# Altium project wisp-5-0.PrjPcb
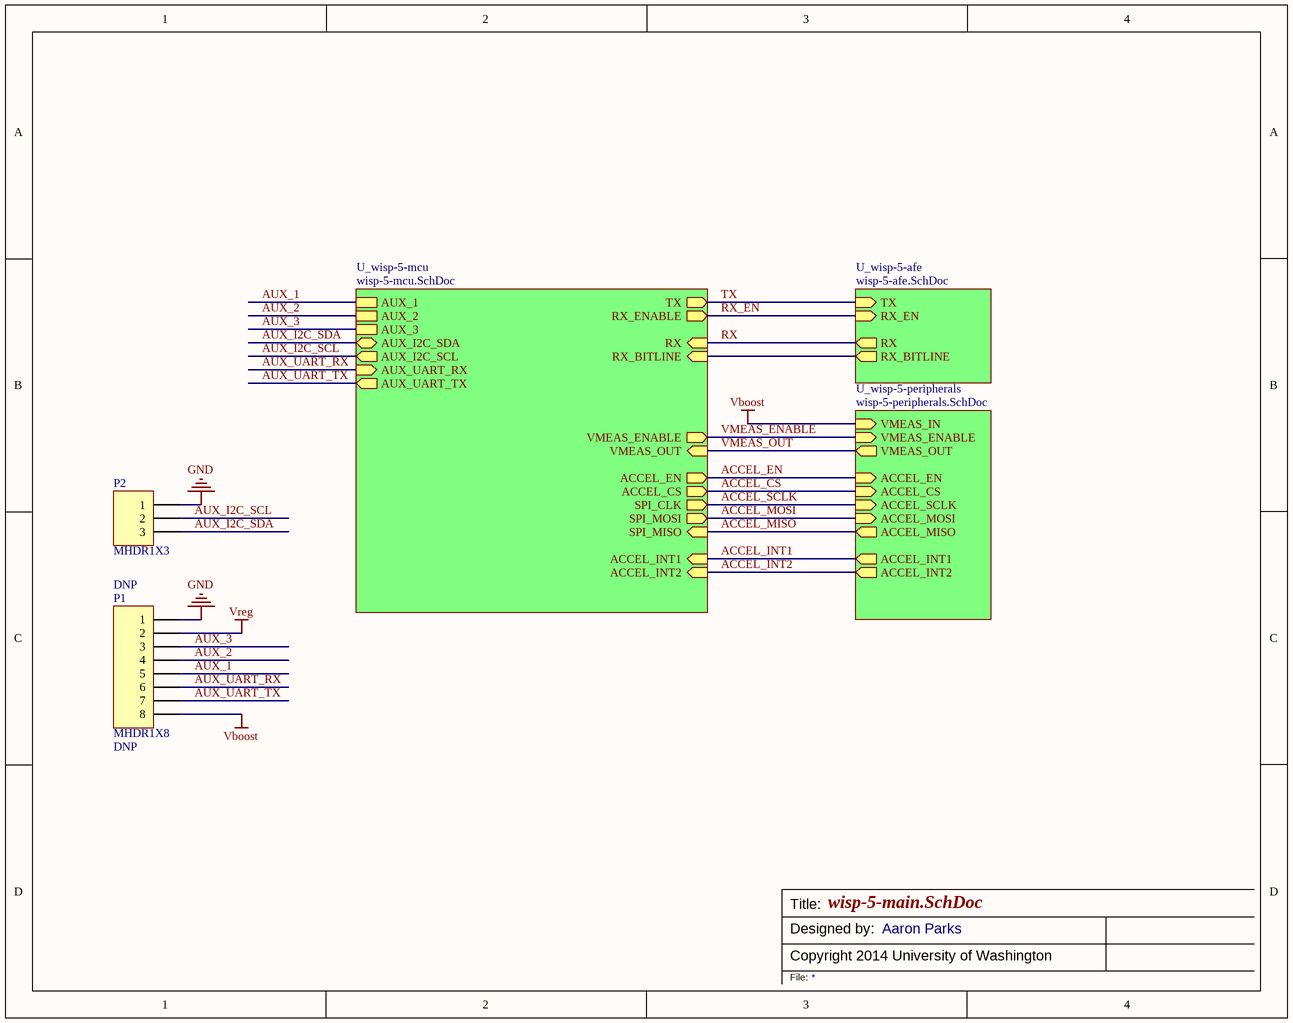
[diagram p0: wisp-5-main.SchDoc]
4 sheets, 43 parts. Net scope: hierarchical (ports join the sheet entries above them; power ports are global).
Board file: wisp5-form-factor-dipole.PcbDoc
Sheets:
  wisp-5-main.SchDoc
    U_wisp-5-mcu = wisp-5-mcu.SchDoc
    U_wisp-5-afe = wisp-5-afe.SchDoc
    U_wisp-5-peripherals = wisp-5-peripherals.SchDoc

## Sheet wisp-5-main.SchDoc
size A

### Parts
P1  MHDR1X8  [MHDR1X8]
P2  MHDR1X3  [MHDR1X3]

### Sub-sheets
U_wisp-5-afe = wisp-5-afe.SchDoc: TX (in), RX_EN (in), RX (out), RX_BITLINE (out)
U_wisp-5-mcu = wisp-5-mcu.SchDoc: RX (in), ACCEL_INT1 (in), ACCEL_INT2 (in), TX (out), RX_ENABLE (out), VMEAS_ENABLE (out), ACCEL_CS (out), SPI_MOSI (out), SPI_MISO (in), SPI_CLK (out), AUX_I2C_SCL (out), AUX_I2C_SDA (bidir), VMEAS_OUT (in), ACCEL_EN (out), AUX_UART_TX (out), AUX_UART_RX (in), AUX_1, AUX_2, AUX_3, RX_BITLINE (in)
U_wisp-5-peripherals = wisp-5-peripherals.SchDoc: VMEAS_IN (in), VMEAS_OUT (out), VMEAS_ENABLE (in), ACCEL_INT1 (out), ACCEL_INT2 (out), ACCEL_SCLK (in), ACCEL_MOSI (in), ACCEL_MISO (out), ACCEL_CS (in), ACCEL_EN (in)

### Nets
GND: P1.1 P2.1
Vboost: P1.8 ; sheet U_wisp-5-peripherals/VMEAS_IN
Vreg: P1.2
ACCEL_CS: sheet U_wisp-5-mcu/ACCEL_CS, sheet U_wisp-5-peripherals/ACCEL_CS
ACCEL_EN: sheet U_wisp-5-mcu/ACCEL_EN, sheet U_wisp-5-peripherals/ACCEL_EN
ACCEL_INT1: sheet U_wisp-5-mcu/ACCEL_INT1, sheet U_wisp-5-peripherals/ACCEL_INT1
ACCEL_INT2: sheet U_wisp-5-mcu/ACCEL_INT2, sheet U_wisp-5-peripherals/ACCEL_INT2
ACCEL_MISO: sheet U_wisp-5-mcu/SPI_MISO, sheet U_wisp-5-peripherals/ACCEL_MISO
ACCEL_MOSI: sheet U_wisp-5-mcu/SPI_MOSI, sheet U_wisp-5-peripherals/ACCEL_MOSI
ACCEL_SCLK: sheet U_wisp-5-mcu/SPI_CLK, sheet U_wisp-5-peripherals/ACCEL_SCLK
AUX_1: P1.5 ; sheet U_wisp-5-mcu/AUX_1
AUX_2: P1.4 ; sheet U_wisp-5-mcu/AUX_2
AUX_3: P1.3 ; sheet U_wisp-5-mcu/AUX_3
AUX_I2C_SCL: P2.2 ; sheet U_wisp-5-mcu/AUX_I2C_SCL
AUX_I2C_SDA: P2.3 ; sheet U_wisp-5-mcu/AUX_I2C_SDA
AUX_UART_RX: P1.6 ; sheet U_wisp-5-mcu/AUX_UART_RX
AUX_UART_TX: P1.7 ; sheet U_wisp-5-mcu/AUX_UART_TX
BITLINE: sheet U_wisp-5-mcu/RX_BITLINE, sheet U_wisp-5-afe/RX_BITLINE
RX: sheet U_wisp-5-mcu/RX, sheet U_wisp-5-afe/RX
RX_EN: sheet U_wisp-5-mcu/RX_ENABLE, sheet U_wisp-5-afe/RX_EN
TX: sheet U_wisp-5-mcu/TX, sheet U_wisp-5-afe/TX
VMEAS_ENABLE: sheet U_wisp-5-mcu/VMEAS_ENABLE, sheet U_wisp-5-peripherals/VMEAS_ENABLE
VMEAS_OUT: sheet U_wisp-5-mcu/VMEAS_OUT, sheet U_wisp-5-peripherals/VMEAS_OUT

### Notes on the sheet
- Title:
- Copyright 2014 University of Washington
- Designed by:
- Aaron Parks
- File:

### Library data of the parts
P1 = MHDR1X8: Header, 8-Pin; DNP: DNP
P2 = MHDR1X3: Header, 3-Pin; DNP: DNP

## Sheet wisp-5-mcu.SchDoc
size A
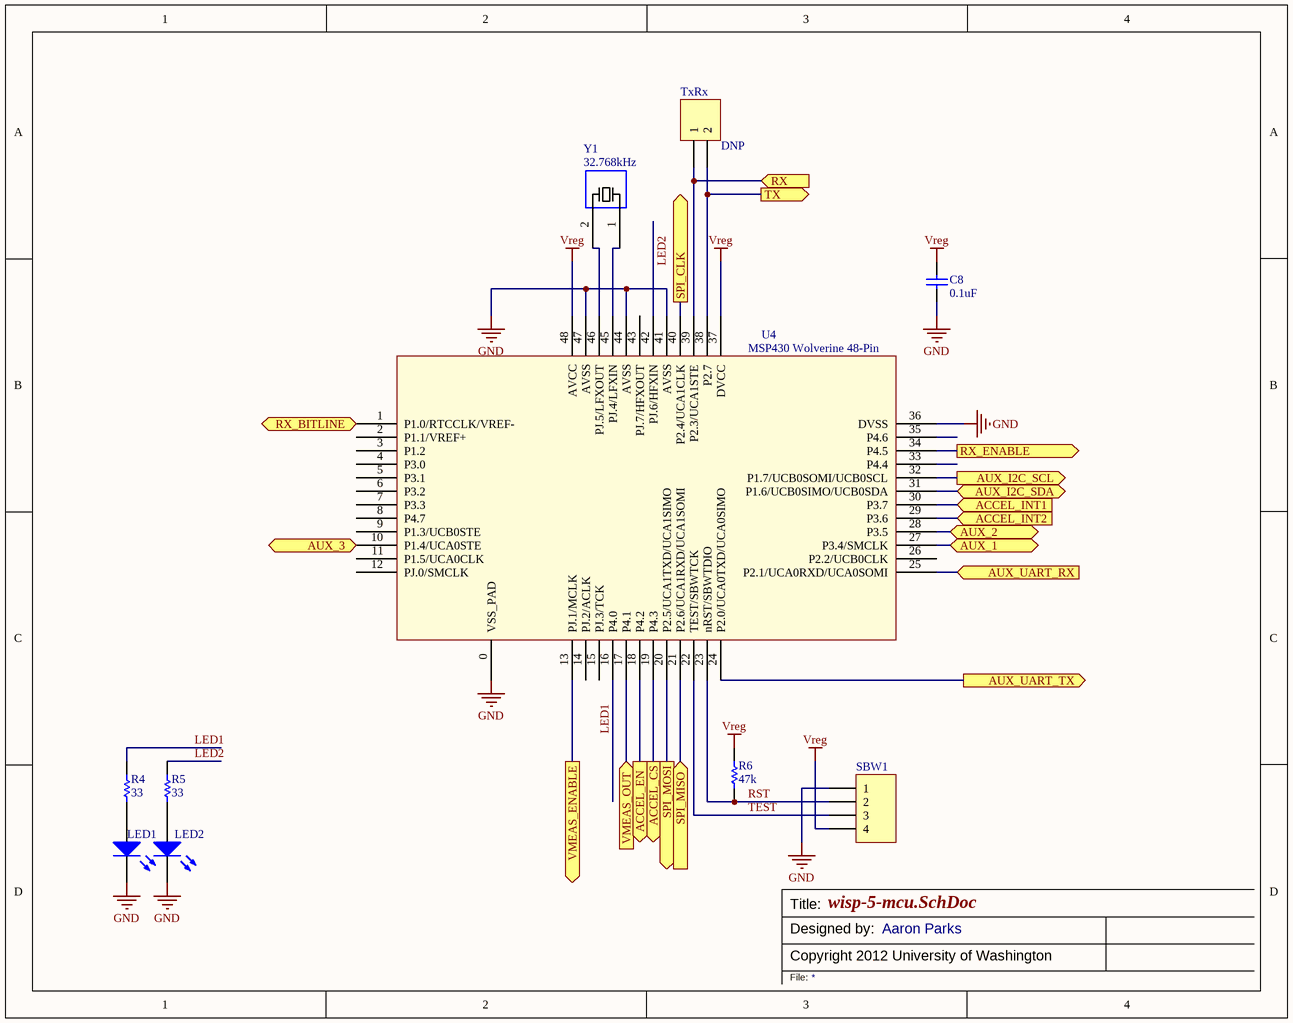
[diagram p1: wisp-5-mcu.SchDoc]

### Parts
C8  value 0.1uF  [0402]  (hidden comment: Cap)
LED1  LED  [Diode - 0603]  (value not drawn)
LED2  LED  [Diode - 0603]  (value not drawn)
R4  value 33  [0402]  (hidden comment: Res)
R5  value 33  [0402]  (hidden comment: Res)
R6  value 47k  [0402]  (hidden comment: Res)
SBW1  4-Pin 0.05" Pitch Female Rt Angle Header  [MHDR1X4]  (value not drawn)
TxRx  MHDR1X2  [MHDR1X2]  (value not drawn)
U4  MSP430 Wolverine 48-Pin  [MSP_QFN48_RGZ_PAD0]
Y1  value 32.768kHz  [XTAL [3.20mm x 1.50mm]]  (hidden comment: XTAL)

### Ports
ACCEL_CS (out), ACCEL_EN (out), ACCEL_INT1 (in), ACCEL_INT2 (in), AUX_1, AUX_2, AUX_3, AUX_I2C_SCL (out), AUX_I2C_SDA (bidir), AUX_UART_RX (in), AUX_UART_TX (out), RX (in), RX_BITLINE (in), RX_ENABLE (out), SPI_CLK (out), SPI_MISO (in), SPI_MOSI (out), TX (out), VMEAS_ENABLE (out), VMEAS_OUT (in)

### Nets
GND: C8.1 LED1.2(K) LED2.2(K) SBW1.1 U4.0(VSS_PAD) U4.36(DVSS) U4.41(AVSS) U4.44(AVSS) U4.47(AVSS)
Vreg: C8.2 R6.2 SBW1.4 U4.37(DVCC) U4.48(AVCC)
ACCEL_CS: U4.19(P4.3) ; port ACCEL_CS
ACCEL_EN: U4.18(P4.2) ; port ACCEL_EN
ACCEL_INT1: U4.30(P3.7) ; port ACCEL_INT1
ACCEL_INT2: U4.29(P3.6) ; port ACCEL_INT2
ACCEL_MISO: U4.21(P2.6/UCA1RXD/UCA1SOMI) ; port SPI_MISO
ACCEL_MOSI: U4.20(P2.5/UCA1TXD/UCA1SIMO) ; port SPI_MOSI
ACCEL_SCLK: U4.40(P2.4/UCA1CLK) ; port SPI_CLK
AUX_1: U4.27(P3.4/SMCLK) ; port AUX_1
AUX_2: U4.28(P3.5) ; port AUX_2
AUX_3: U4.10(P1.4/UCA0STE) ; port AUX_3
AUX_I2C_SCL: U4.32(P1.7/UCB0SOMI/UCB0SCL) ; port AUX_I2C_SCL
AUX_I2C_SDA: U4.31(P1.6/UCB0SIMO/UCB0SDA) ; port AUX_I2C_SDA
AUX_UART_RX: U4.25(P2.1/UCA0RXD/UCA0SOMI) ; port AUX_UART_RX
AUX_UART_TX: U4.24(P2.0/UCA0TXD/UCA0SIMO) ; port AUX_UART_TX
BITLINE: U4.1(P1.0/RTCCLK/VREF-) ; port RX_BITLINE
LED1: R4.2 U4.16(P4.0)
LED2: R5.2 U4.42(PJ.6/HFXIN)
RST: R6.1 SBW1.2 U4.23(nRST/SBWTDIO)
RX: TxRx.1 U4.39(P2.3/UCA1STE) ; port RX
RX_EN: U4.34(P4.5) ; port RX_ENABLE
TEST: SBW1.3 U4.22(TEST/SBWTCK)
TX: TxRx.2 U4.38(P2.7) ; port TX
VMEAS_ENABLE: U4.13(PJ.1/MCLK) ; port VMEAS_ENABLE
VMEAS_OUT: U4.17(P4.1) ; port VMEAS_OUT
NetLED1_1: LED1.1(A) R4.1
NetLED2_1: LED2.1(A) R5.1
NetU4_45: U4.45(PJ.4/LFXIN) Y1.1
NetU4_46: U4.46(PJ.5/LFXOUT) Y1.2

Not connected (* = marked no-connect by the designer): U4 2(P1.1/VREF+) 3(P1.2) 4(P3.0) 5(P3.1) 6(P3.2) 7(P3.3) 8(P4.7) 9(P1.3/UCB0STE) 11(P1.5/UCA0CLK) 12(PJ.0/SMCLK) 14(PJ.2/ACLK) 15(PJ.3/TCK) 26(P2.2/UCB0CLK) 33(P4.4) 35(P4.6) 43(PJ.7/HFXOUT)

### Notes on the sheet
- Title:
- Copyright 2012 University of Washington
- Designed by:
- Aaron Parks
- File:

### Library data of the parts
C8 = Cap: Ceramic Capacitor (Surface Mount); Manufacturer: Murata; Manufacturer Part Number: GRM155R71C104KA88D; Digi-Key Part Number: 490-3261-1-ND; Note: *; Rating: *
LED1 LED2 = Diode - LED: Typical RED, GREEN, YELLOW, AMBER GaAs LED; Manufacturer: OSRAM; Manufacturer Part Number: LS L29K-G1J2-1-Z; Digi-Key Part Number: 475-2506-1-ND; Note: *; Value: *; Rating: *
R4 R5 = Res: Chip Resistor (Surface Mount); Manufacturer: Panasonic; Manufacturer Part Number: ERJ-2RKF33R0X; Digi-Key Part Number: P33.0LCT-ND; Rating: *; Note: *
R6 = Res: Chip Resistor (Surface Mount); Manufacturer: Panasonic; Manufacturer Part Number: ERJ-2RKF4702X; Digi-Key Part Number: P47.0KLCT-ND; Rating: *; Note: *
SBW1 = MHDR1X4: Header, 4-Pin; Manufacturer Part Number: 851-43-004-20-001000; Manufacturer: Mill-Max Manufacturing; Digi-Key Part Number: ED90474-ND
TxRx = MHDR1X2: Header, 2-Pin; DNP: DNP
U4 = MSP430FR596X_586X_RGZ: 16-bit FRAM MCU; Manufacturer: Texas Instruments; Manufacturer Part Number: MSP430FR5969IRGZR; Datasheet Link: http://www.ti.com/lit/gpn/msp430fr5969; Digi-Key Part Number: 296-37875-1-ND
Y1 = XTAL 2-pins: Crystal Oscillator - [3.20mm x 1.50mm]; Manufacturer: Epson Toyocom Corporation; Manufacturer Part Number: FC-135 32.7680KA-A3; Digi-Key Part Number: SE2413CT-ND

## Sheet wisp-5-afe.SchDoc
size Letter
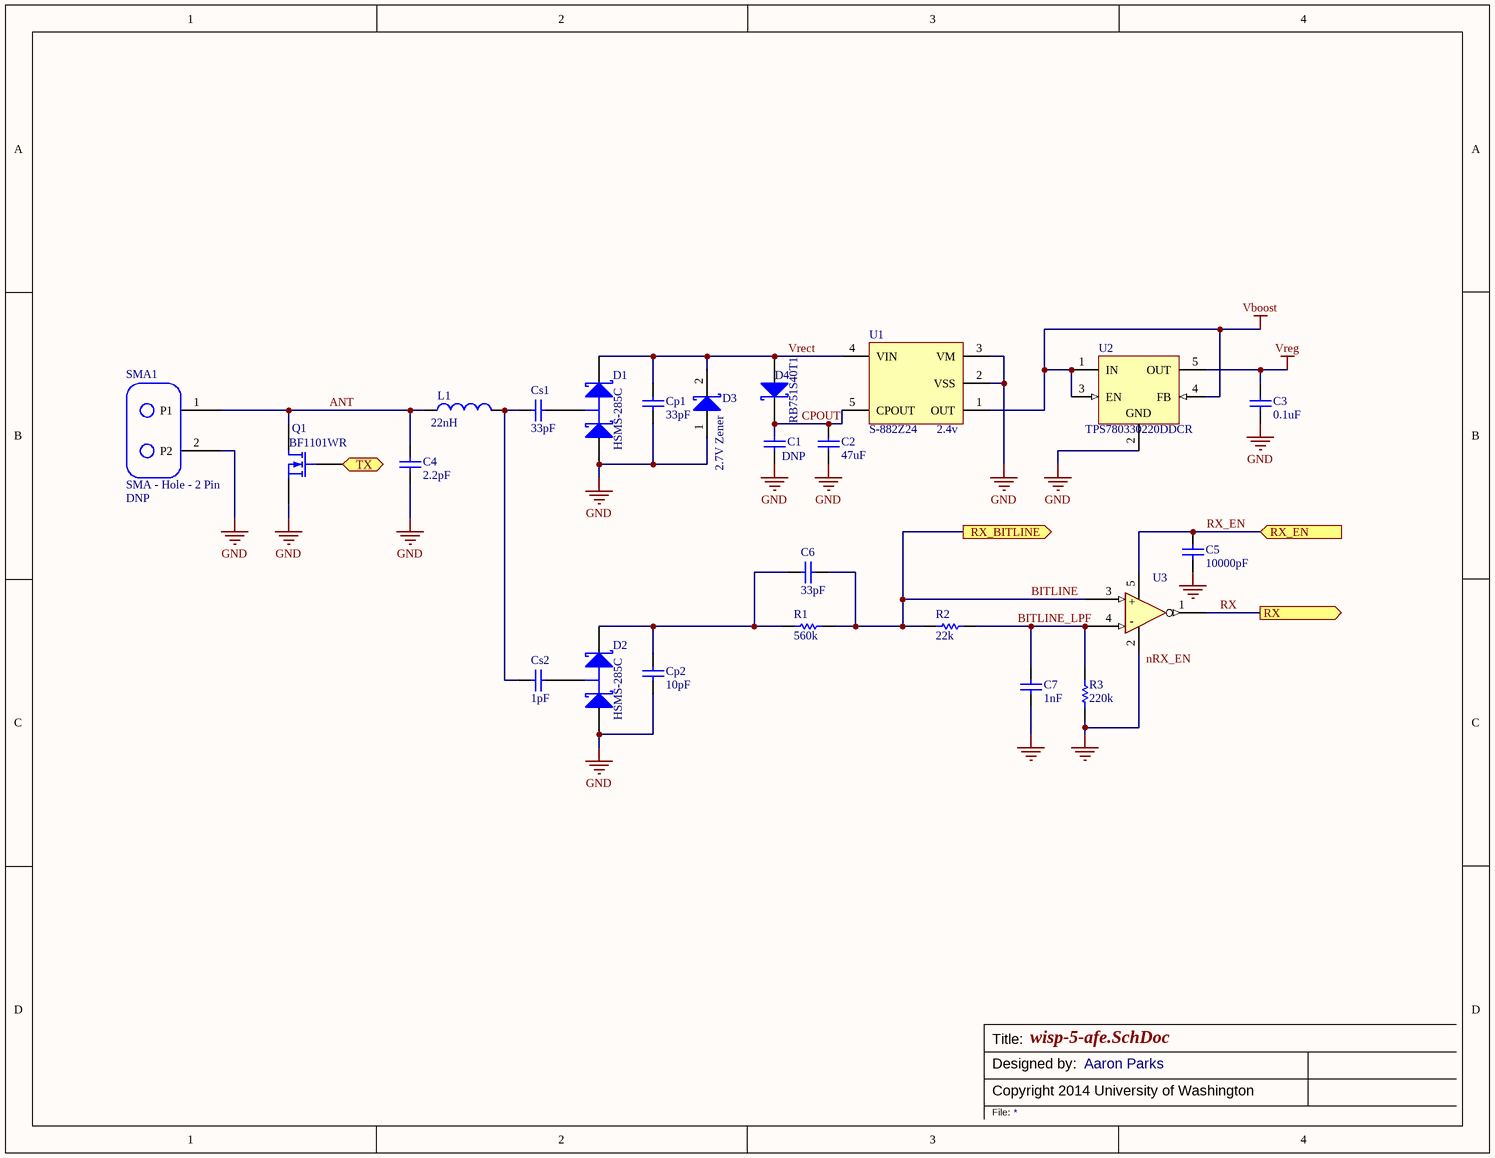
[diagram p2: wisp-5-afe.SchDoc]

### Parts
C1  Cap  [0805]  (value not drawn)
C2  value 47uF  [0805]  (hidden comment: Cap)
C3  value 0.1uF  [0402]  (hidden comment: Cap)
C4  value 2.2pF  [0402]  (hidden comment: Cap)
C5  value 10000pF  [0402]  (hidden comment: Cap)
C6  value 33pF  [0402]  (hidden comment: Cap)
C7  value 1nF  [0402]  (hidden comment: Cap)
Cp1  value 33pF  [0402]  (hidden comment: Cap)
Cp2  value 10pF  [0402]  (hidden comment: Cap)
Cs1  value 33pF  [0402]  (hidden comment: Cap)
Cs2  value 1pF  [0402]  (hidden comment: Cap)
D1  HSMS-285C  [SOT-323, HSMS-285C]
D2  HSMS-285C  [SOT-323, HSMS-285C]
D3  2.7V Zener  [DIOD-SOD-123-2_V]
D4  RB751S40T1  [SOD-523]
L1  value 22nH  [0603]  (hidden comment: Ind)
Q1  BF1101WR  [SOT343R]
R1  value 560k  [0402]  (hidden comment: Res)
R2  value 22k  [0402]  (hidden comment: Res)
R3  value 220k  [0402]  (hidden comment: Res)
SMA1  SMA - Hole - 2 Pin  [SMA - Hole - 2 Pin]
U1  S-882Z24  value 2.4v  [SOT23-5]
U2  TPS780330220DDCR  [TI-DDC5_L]
U3  Comparator  [SC70-5]  (value not drawn)

### Ports
RX (out), RX_BITLINE (out), RX_EN (in), TX (in)

### Nets
GND: C1.2 C2.2 C3.1 C4.1 C5.2 C7.2 Cp1.2 Cp2.2 D1.1(A) D2.1(A) D3.1(A) Q1.1(S) R3.2 SMA1.2(P2) U1.2(VSS) U1.3(VM) U2.2(GND) U3.2(Gnd)
Vboost: U1.1(OUT) U2.1(IN) U2.3(EN) U2.4(FB)
Vreg: C3.2 U2.5(OUT)
ANT: C4.2 L1.1 Q1.2(D) SMA1.1(P1)
BITLINE: C6.2 R1.1 R2.2 U3.3(IN+) ; port RX_BITLINE
BITLINE_LPF: C7.1 R2.1 R3.1 U3.4(In-)
CPOUT: C1.1 C2.1 D4.1(C) U1.5(CPOUT)
RX: U3.1(OUT) ; port RX
RX_EN: C5.1 U3.5(VDD) ; port RX_EN
TX: Q1.3(G) ; port TX
Vrect: Cp1.1 D1.2(K) D3.2(K) D4.2(A) U1.4(VIN)
NetC6_1: C6.1 Cp2.1 D2.2(K) R1.2
NetCs1_1: Cs1.1 Cs2.1 L1.2
NetCs1_2: Cs1.2 D1.3(C)
NetCs2_2: Cs2.2 D2.3(C)

### Notes on the sheet
- Title:
- Copyright 2014 University of Washington
- Designed by:
- Aaron Parks
- File:
- Labels drawn without touching a wire or pin: nRX_EN
- (in symbol NCS2200) +; -

### Library data of the parts
C1 = Cap: Ceramic Capacitor (Surface Mount); Value: DNP; Digi-Key Part Number: *; Manufacturer Part Number: *; Note: *; Rating: *; DNP: DNP
C2 = Cap: Ceramic Capacitor (Surface Mount); Manufacturer: Samsung Electro-Mechanics; Manufacturer Part Number: CL21A476MQCLRNC; Rating: 6.3V; Digi-Key Part Number: 1276-2420-1-ND; Note: *
C3 = Cap: as C8 on sheet wisp-5-mcu; Digi-Key Part Number: 490-3261-1-ND; Note: *; Rating: *
C4 = Cap: Ceramic Capacitor (Surface Mount); Manufacturer: Johanson; Manufacturer Part Number: 500R07S5R6CV4T; Digi-Key Part Number: 712-1289-1-ND; Note: *; Rating: *
C5 = Cap: Ceramic Capacitor (Surface Mount); Manufacturer: Generic Ceramic Chip Cap (TBD); Manufacturer Part Number: CL05B103KP5NNNC; Digi-Key Part Number: 1276-1502-1-ND; Note: *; Rating: *
C6 Cp1 Cs1 = Cap: Ceramic Capacitor (Surface Mount); Manufacturer: Johanson; Manufacturer Part Number: 500R07S330JV4T; Digi-Key Part Number: 712-1298-1-ND; Note: *; Rating: *
C7 = Cap: Ceramic Capacitor (Surface Mount); Manufacturer: Generic Ceramic Chip Cap (TBD); Manufacturer Part Number: GRM1555C1H102JA01D; Digi-Key Part Number: 490-3244-1-ND; Note: *; Rating: *
Cp2 = Cap: Ceramic Capacitor (Surface Mount); Manufacturer: Johanson; Manufacturer Part Number: 500R07S100JV4T; Digi-Key Part Number: 712-1253-1-ND; Note: *; Rating: *
Cs2 = Cap: Ceramic Capacitor (Surface Mount); Manufacturer: Johanson; Manufacturer Part Number: 500R07S1R0BV4T; Digi-Key Part Number: 712-1266-1-ND; Note: *; Rating: *
D1 D2 = HSMS-285C: Agilent Schottky Diode, Two in Series, Small Package SOT-323; Manufacturer: Avago Technologies US Inc.; Manufacturer Part Number: HSMS-285C-BLKG; Note: *; Digi-Key Part Number: 516-2558-ND; Rating: *; Value: *
D3 = CMP-0303-00003-1: 1.0 A Surface Mount Schottky Barrier Rectifier, 40 V, -65 to 125 degC, 2-Pin SOD-123 Package, RoHS, Tape and Reel; Manufacturer Part Number: MMSZ4682T1G; Manufacturer: ON Semiconductor; Note: This component's footprint matches the one we needed. The PartNumber is for the right component.; PackageDescription: 2-Pin SOD-123, Body 2.7 x 1.55 mm, Pitch 3.7 mm; PackageReference: SOD-123-2; Digi-Key Part Number: MMSZ4682T1GOSCT-ND
D4 = RB751S40T1: Schottky Diode; Manufacturer Part Number: RB751S40T1G; Manufacturer: ON Semiconductor; Note: *; Digi-Key Part Number: RB751S40T1GOSCT-ND
L1 = Ind: Inductor (Surface Mount); Manufacturer: Coilcraft (http://www.coilcraft.com/0402cs.cfm); Manufacturer Part Number: 0402CS-16NX_LU; Digi-Key Part Number: N/A; Rating: *; Note: *
Q1 = BF1101WR: N-Channel Dual-Gate Mos-Fets MOSFET, SOT343R; Manufacturer Part Number: BF1101WR,115; Manufacturer: NXP Semiconductors; Digi-Key Part Number: 568-6140-1-ND; Rating: *; Value: *; Note: *
R1 = Res: Chip Resistor (Surface Mount); Manufacturer: Panasonic; Manufacturer Part Number: ERJ-2RKF5603X; Digi-Key Part Number: P560KLCT-ND; Rating: *; Note: *
R2 = Res: Chip Resistor (Surface Mount); Manufacturer: Panasonic; Manufacturer Part Number: ERJ-2RKF2202X; Digi-Key Part Number: P22.0KLCT-ND; Rating: *; Note: *
R3 = Res: Chip Resistor (Surface Mount); Manufacturer: Panasonic; Manufacturer Part Number: ERJ-2RKF2203X; Digi-Key Part Number: P220KLCT-ND; Rating: *; Note: *
SMA1 = SMA - Hole - 2 Pin: Two pin SMA connector wisp; Note: This part is used to attach the antennae to WISP in the layout; DNP: DNP
U1 = S-882Zxx: ULTRA-LOW VOLTAGE OPERATION CHARGE PUMP IC  FOR STEP-UP DC-DC CONVERTER STARTUP; Manufacturer: Seiko Instruments; Manufacturer Part Number: S-882Z24-M5T1G; Digi-Key Part Number: S-882Z24-M5T1G-ND; Rating: *; Note: *
U2 = CMP-0394-01119-1: Single Output LDO, 150 mA, Adjustable 1.22 to 5.25 V Output, 2.2 to 5.5 V Input, with 500 nA Quiescent Current, 5-pin SOT (DDC), -40 to 125 degC, Green (RoHS & no Sb/Br); Manufacturer: Texas Instruments; PackageReference: DDC5; Manufacturer Part Number: TPS780330220DDCR; PackageVersion: 4204403-2/E; Note: *; Digi-Key Part Number: 296-23332-1-ND
U3 = NCS2200: Comparator: On Semi 10uA Comparator; Manufacturer: ON Semiconductor; Manufacturer Part Number: NCS2200SQ2T2G; Digi-Key Part Number: NCS2200SQ2T2GOSCT-ND; Rating: *; Value: *; Note: *

## Sheet wisp-5-peripherals.SchDoc
size A
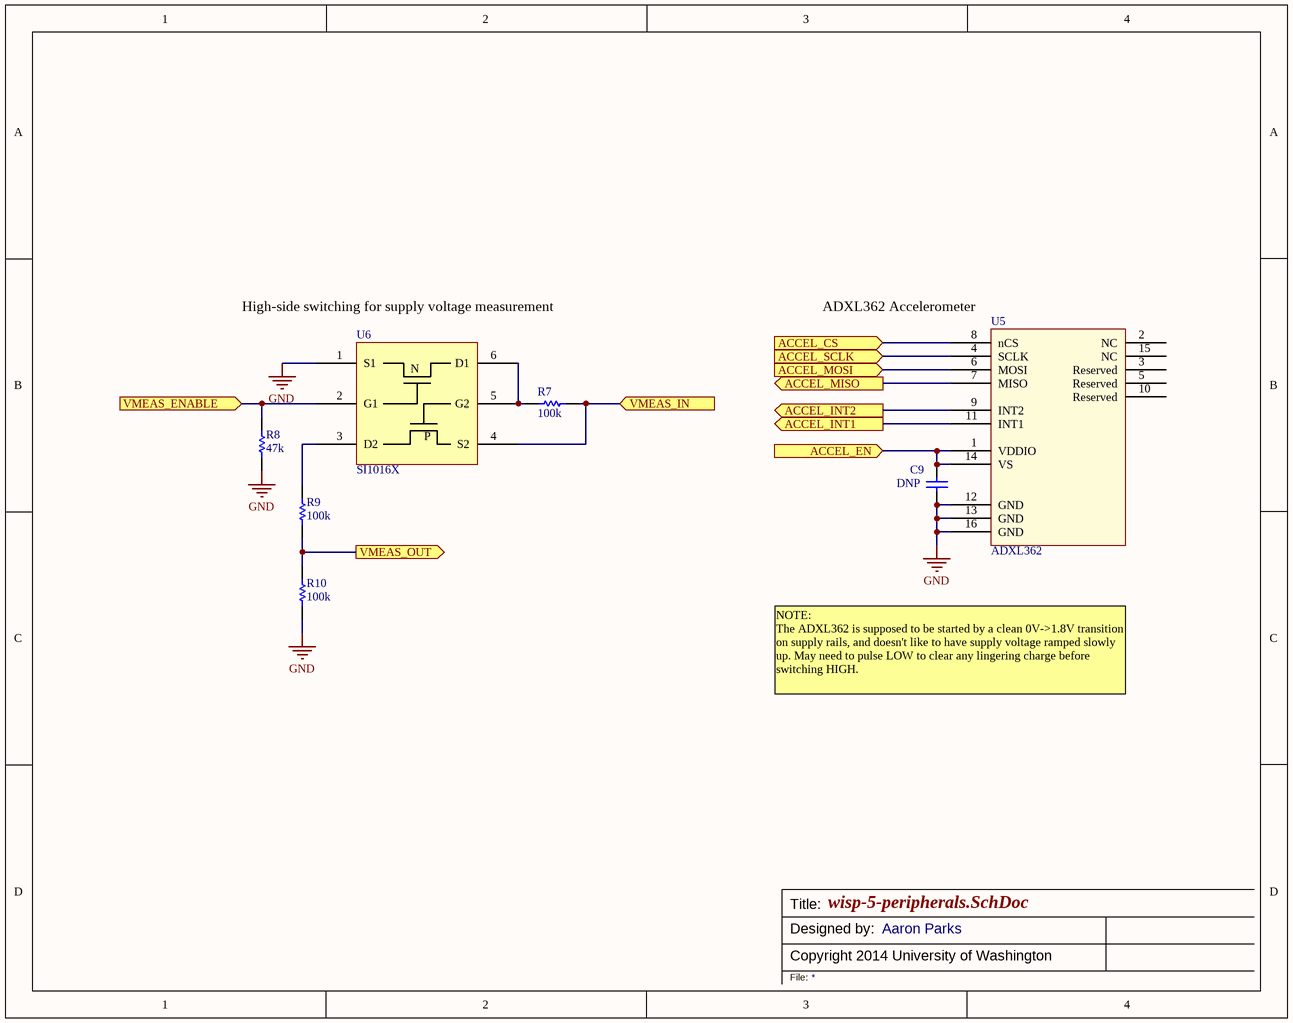
[diagram p3: wisp-5-peripherals.SchDoc]

### Parts
C9  Cap  [0402]  (value not drawn)
R7  value 100k  [0402]  (hidden comment: Res)
R8  value 47k  [0402]  (hidden comment: Res)
R9  value 100k  [0402]  (hidden comment: Res)
R10  value 100k  [0402]  (hidden comment: Res)
U5  ADXL362  [ADXL362]
U6  SI1016X  [SC-89-6 Vishay]

### Ports
ACCEL_CS (in), ACCEL_EN (in), ACCEL_INT1 (out), ACCEL_INT2 (out), ACCEL_MISO (out), ACCEL_MOSI (in), ACCEL_SCLK (in), VMEAS_ENABLE (in), VMEAS_IN (in), VMEAS_OUT (out)

### Nets
GND: C9.1 R8.1 R10.1 U5.12(GND) U5.13(GND) U5.16(GND) U6.1(S1)
Vboost: R7.1 U6.4(S2) ; port VMEAS_IN
ACCEL_CS: U5.8(nCS) ; port ACCEL_CS
ACCEL_EN: C9.2 U5.1(VDDIO) U5.14(VS) ; port ACCEL_EN
ACCEL_INT1: U5.11(INT1) ; port ACCEL_INT1
ACCEL_INT2: U5.9(INT2) ; port ACCEL_INT2
ACCEL_MISO: U5.7(MISO) ; port ACCEL_MISO
ACCEL_MOSI: U5.6(MOSI) ; port ACCEL_MOSI
ACCEL_SCLK: U5.4(SCLK) ; port ACCEL_SCLK
VMEAS_ENABLE: R8.2 U6.2(G1) ; port VMEAS_ENABLE
VMEAS_OUT: R9.1 R10.2 ; port VMEAS_OUT
NetR7_2: R7.2 U6.5(G2) U6.6(D1)
NetR9_2: R9.2 U6.3(D2)

Not connected (* = marked no-connect by the designer): U5 2(NC) 3(Reserved) 5(Reserved) 10(Reserved) 15(NC)

### Notes on the sheet
- (near U6) High-side switching for supply voltage measurement
- (near U5) ADXL362 Accelerometer
- NOTE:
  The ADXL362 is supposed to be started by a clean 0V->1.8V transition on supply rails, and doesn't like to have supply voltage ramped slowly up. May need to pulse LOW to clear any lingering charge before switching HIGH.
- Title:
- Copyright 2014 University of Washington
- Designed by:
- Aaron Parks
- File:
- (in symbol SI1016X) N; P

### Library data of the parts
C9 = Cap: as C1 on sheet wisp-5-afe; Digi-Key Part Number: *; Manufacturer Part Number: *; DNP: DNP; Rating: *
R7 R9 R10 = Res: Chip Resistor (Surface Mount); Manufacturer: Panasonic; Manufacturer Part Number: ERJ-2RKF1003X; Digi-Key Part Number: P100KLCT-ND; Rating: *
R8 = Res: as R6 on sheet wisp-5-mcu; Digi-Key Part Number: P47.0KLCT-ND; Rating: *
U5 = ADXL362: Analog Devices low power accelerometer; Manufacturer Part Number: ADXL362BCCZ-RL7; Digi-Key Part Number: ADXL362BCCZ-RL7CT-ND; Manufacturer: Analog Devices
U6 = SI1016X: NMOS and PMOS array; Manufacturer Part Number: SI1016X-T1-GE3; Manufacturer: Vishay Siliconix; Digi-Key Part Number: SI1016X-T1-GE3CT-ND

## Nets that join several sheets
GND: wisp-5-main (P1.1 P2.1), wisp-5-mcu (9 pins), wisp-5-afe (18 pins), wisp-5-peripherals (7 pins)
Vboost: wisp-5-main (P1.8), wisp-5-afe (U1.1 U2.1 U2.3 U2.4), wisp-5-peripherals (R7.1 U6.4)
Vreg: wisp-5-main (P1.2), wisp-5-mcu (5 pins), wisp-5-afe (C3.2 U2.5)
ACCEL_CS: wisp-5-mcu (U4.19), wisp-5-peripherals (U5.8)
ACCEL_EN: wisp-5-mcu (U4.18), wisp-5-peripherals (C9.2 U5.1 U5.14)
ACCEL_INT1: wisp-5-mcu (U4.30), wisp-5-peripherals (U5.11)
ACCEL_INT2: wisp-5-mcu (U4.29), wisp-5-peripherals (U5.9)
ACCEL_MISO: wisp-5-mcu (U4.21), wisp-5-peripherals (U5.7)
ACCEL_MOSI: wisp-5-mcu (U4.20), wisp-5-peripherals (U5.6)
ACCEL_SCLK: wisp-5-mcu (U4.40), wisp-5-peripherals (U5.4)
AUX_1: wisp-5-main (P1.5), wisp-5-mcu (U4.27)
AUX_2: wisp-5-main (P1.4), wisp-5-mcu (U4.28)
AUX_3: wisp-5-main (P1.3), wisp-5-mcu (U4.10)
AUX_I2C_SCL: wisp-5-main (P2.2), wisp-5-mcu (U4.32)
AUX_I2C_SDA: wisp-5-main (P2.3), wisp-5-mcu (U4.31)
AUX_UART_RX: wisp-5-main (P1.6), wisp-5-mcu (U4.25)
AUX_UART_TX: wisp-5-main (P1.7), wisp-5-mcu (U4.24)
BITLINE: wisp-5-mcu (U4.1), wisp-5-afe (C6.2 R1.1 R2.2 U3.3)
RX: wisp-5-mcu (TxRx.1 U4.39), wisp-5-afe (U3.1)
RX_EN: wisp-5-mcu (U4.34), wisp-5-afe (C5.1 U3.5)
TX: wisp-5-mcu (TxRx.2 U4.38), wisp-5-afe (Q1.3)
VMEAS_ENABLE: wisp-5-mcu (U4.13), wisp-5-peripherals (R8.2 U6.2)
VMEAS_OUT: wisp-5-mcu (U4.17), wisp-5-peripherals (R9.1 R10.2)